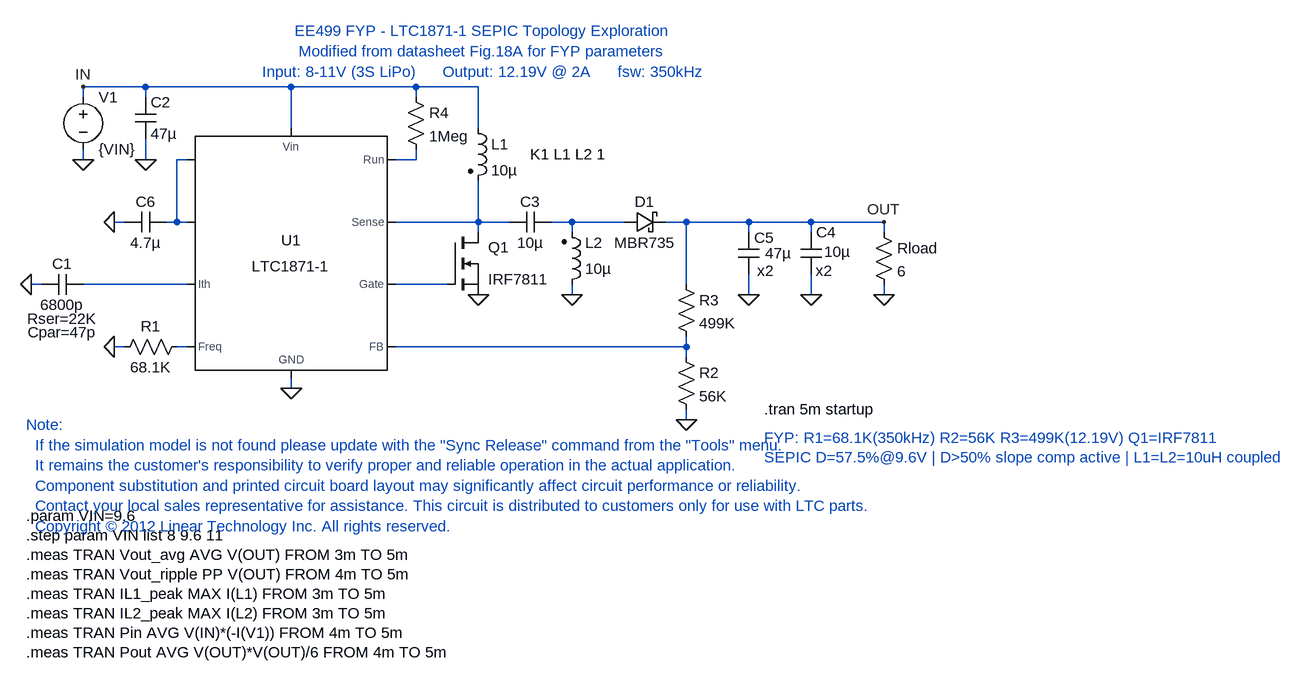
[diagram p0: schematic LTC1871_SEPIC_FYP.asc]
LTC1871_SEPIC_FYP.asc, the LTspice schematic file:
Version 4.1
SHEET 1 2880 2020
WIRE 1408 1120 1312 1120
WIRE 1632 1120 1408 1120
WIRE 1824 1120 1632 1120
WIRE 1920 1120 1824 1120
WIRE 1312 1136 1312 1120
WIRE 1408 1136 1408 1120
WIRE 1824 1136 1824 1120
WIRE 1632 1184 1632 1120
WIRE 1920 1184 1920 1120
WIRE 1312 1232 1312 1216
WIRE 1408 1232 1408 1200
WIRE 1472 1232 1456 1232
WIRE 1824 1232 1824 1216
WIRE 1824 1232 1792 1232
WIRE 1376 1328 1360 1328
WIRE 1456 1328 1456 1232
WIRE 1456 1328 1440 1328
WIRE 1472 1328 1456 1328
WIRE 1920 1328 1920 1264
WIRE 1920 1328 1792 1328
WIRE 1968 1328 1920 1328
WIRE 2064 1328 2032 1328
WIRE 2144 1328 2064 1328
WIRE 2240 1328 2208 1328
WIRE 2336 1328 2240 1328
WIRE 2432 1328 2336 1328
WIRE 2544 1328 2432 1328
WIRE 1920 1344 1920 1328
WIRE 2064 1344 2064 1328
WIRE 2336 1344 2336 1328
WIRE 2432 1344 2432 1328
WIRE 2544 1344 2544 1328
WIRE 1248 1424 1232 1424
WIRE 1472 1424 1312 1424
WIRE 1872 1424 1792 1424
WIRE 2240 1424 2240 1328
WIRE 2064 1440 2064 1424
WIRE 2336 1440 2336 1408
WIRE 2432 1440 2432 1408
WIRE 2544 1440 2544 1424
WIRE 1376 1520 1360 1520
WIRE 1472 1520 1456 1520
WIRE 2240 1520 2240 1504
WIRE 2240 1520 1792 1520
WIRE 2240 1536 2240 1520
WIRE 1632 1584 1632 1568
WIRE 2240 1632 2240 1616
FLAG 1920 1440 0
FLAG 1360 1520 0
FLAG 2240 1632 0
FLAG 1632 1584 0
FLAG 2336 1440 0
FLAG 1232 1424 0
FLAG 2544 1440 0
FLAG 1312 1232 0
FLAG 1360 1328 0
FLAG 1312 1120 IN
FLAG 2544 1328 OUT
FLAG 1408 1232 0
FLAG 2064 1440 0
FLAG 2432 1440 0
SYMBOL NMOS 1872 1344 R0
WINDOW 0 63 23 Left 2
WINDOW 3 63 72 Left 2
SYMATTR InstName Q1
SYMATTR Value IRF7811
SYMBOL RES 1472 1504 R90
WINDOW 0 0 56 VBottom 2
WINDOW 3 32 56 VTop 2
SYMATTR InstName R1
SYMATTR Value 68.1K
SYMBOL res 2224 1520 R0
SYMATTR InstName R2
SYMATTR Value 56K
SYMBOL res 2224 1408 R0
SYMATTR InstName R3
SYMATTR Value 499K
SYMBOL ind2 1904 1168 R0
SYMATTR InstName L1
SYMATTR Value 10µ
SYMATTR SpiceLine Rser=0.010
SYMBOL schottky 2144 1344 R270
WINDOW 0 32 32 VTop 2
WINDOW 3 0 32 VBottom 2
SYMATTR InstName D1
SYMATTR Value MBR735
SYMBOL cap 1312 1408 R90
WINDOW 0 0 32 VBottom 2
WINDOW 3 32 32 VTop 2
WINDOW 39 53 32 VTop 2
WINDOW 40 74 32 VTop 2
SYMATTR InstName C1
SYMATTR Value 6800p
SYMATTR SpiceLine Rser=22K
SYMATTR SpiceLine2 Cpar=47p
SYMBOL VOLTAGE 1312 1120 R0
WINDOW 123 0 0 Left 2
WINDOW 39 -4 -48 Left 2
SYMATTR InstName V1
SYMATTR Value {VIN}
SYMBOL ind2 2048 1440 M180
WINDOW 0 36 80 Left 2
WINDOW 3 36 40 Left 2
SYMATTR InstName L2
SYMATTR Value 10µ
SYMATTR SpiceLine Rser=0.010
SYMBOL cap 1392 1136 R0
SYMATTR InstName C2
SYMATTR Value 47µ
SYMATTR SpiceLine Rser=0.002
SYMBOL cap 2032 1312 R90
WINDOW 0 0 32 VBottom 2
WINDOW 3 32 32 VTop 2
SYMATTR InstName C3
SYMATTR Value 10µ
SYMATTR SpiceLine Rser=0.002
SYMBOL res 1808 1120 R0
SYMATTR InstName R4
SYMATTR Value 1Meg
SYMBOL cap 2416 1408 M180
WINDOW 0 24 64 Left 2
WINDOW 3 36 34 Left 2
WINDOW 40 23 5 Left 2
SYMATTR InstName C4
SYMATTR Value 10µ
SYMATTR SpiceLine2 x2
SYMATTR SpiceLine Rser=0.002
SYMBOL PowerProducts\\LTC1871-1 1632 1376 R0
SYMATTR InstName U1
SYMBOL cap 2320 1344 R0
WINDOW 3 41 32 Left 2
WINDOW 40 29 59 Left 2
SYMATTR Value 47µ
SYMATTR SpiceLine2 x2
SYMATTR InstName C5
SYMATTR SpiceLine Rser=.01
SYMBOL cap 1440 1312 R90
WINDOW 0 0 32 VBottom 2
WINDOW 3 32 32 VTop 2
SYMATTR InstName C6
SYMATTR Value 4.7µ
SYMBOL res 2528 1328 R0
SYMATTR InstName Rload
SYMATTR Value 6
TEXT 2000 1224 Left 2 !K1 L1 L2 1
TEXT 2360 1616 Left 2 !.tran 5m startup
TEXT 1928 1112 Bottom 2 ;EE499 FYP - LTC1871-1 SEPIC Topology Exploration\nModified from datasheet Fig.18A for FYP parameters\nInput: 8-11V (3S LiPo)      Output: 12.19V @ 2A      fsw: 350kHz
TEXT 1224 1780 Left 2 !.param VIN=9.6
TEXT 1224 1810 Left 2 !.step param VIN list 8 9.6 11
TEXT 1224 1840 Left 2 !.meas TRAN Vout_avg AVG V(OUT) FROM 3m TO 5m
TEXT 1224 1870 Left 2 !.meas TRAN Vout_ripple PP V(OUT) FROM 4m TO 5m
TEXT 1224 1900 Left 2 !.meas TRAN IL1_peak MAX I(L1) FROM 3m TO 5m
TEXT 1224 1930 Left 2 !.meas TRAN IL2_peak MAX I(L2) FROM 3m TO 5m
TEXT 1224 1960 Left 2 !.meas TRAN Pin AVG V(IN)*(-I(V1)) FROM 4m TO 5m
TEXT 1224 1990 Left 2 !.meas TRAN Pout AVG V(OUT)*V(OUT)/6 FROM 4m TO 5m
TEXT 2360 1660 Left 2 ;FYP: R1=68.1K(350kHz) R2=56K R3=499K(12.19V) Q1=IRF7811
TEXT 2360 1690 Left 2 ;SEPIC D=57.5%@9.6V | D>50% slope comp active | L1=L2=10uH coupled
TEXT 1224 1640 Left 2 ;Note:\n  If the simulation model is not found please update with the "Sync Release" command from the "Tools" menu.\n  It remains the customer's responsibility to verify proper and reliable operation in the actual application.\n  Component substitution and printed circuit board layout may significantly affect circuit performance or reliability.\n  Contact your local sales representative for assistance. This circuit is distributed to customers only for use with LTC parts.\n  Copyright © 2012 Linear Technology Inc. All rights reserved.

The netlist it stands for:
* LTC1871_SEPIC_FYP.asc
M§Q1 N003 N006 0 0 IRF7811
R1 N007 0 68.1K
R2 N008 0 56K
R3 OUT N008 499K
L1 IN N003 10µ Rser=0.010
D1 N004 OUT MBR735
C1 N005 0 6800p Rser=22K Cpar=47p
V1 IN 0 {VIN}
L2 0 N004 10µ Rser=0.010
C2 IN 0 47µ Rser=0.002
C3 N004 N003 10µ Rser=0.002
R4 IN N002 1Meg
C4 0 OUT 10µ Rser=0.002 x2
X§U1 N002 N005 N008 N007 N001 0 N006 N001 IN N003 LTC1871-1  ; pins Run Ith FB Freq ? GND Gate ? Vin Sense
C5 OUT 0 47µ Rser=.01 x2
C6 N001 0 4.7µ
Rload OUT 0 6
.model D D
.lib standard.dio
.model NMOS NMOS
.model PMOS PMOS
.lib standard.mos
K1 L1 L2 1
.tran 5m startup
* EE499 FYP - LTC1871-1 SEPIC Topology Exploration
* Modified from datasheet Fig.18A for FYP parameters
* Input: 8-11V (3S LiPo)      Output: 12.19V @ 2A      fsw: 350kHz
.param VIN=9.6
.step param VIN list 8 9.6 11
.meas TRAN Vout_avg AVG V(OUT) FROM 3m TO 5m
.meas TRAN Vout_ripple PP V(OUT) FROM 4m TO 5m
.meas TRAN IL1_peak MAX I(L1) FROM 3m TO 5m
.meas TRAN IL2_peak MAX I(L2) FROM 3m TO 5m
.meas TRAN Pin AVG V(IN)*(-I(V1)) FROM 4m TO 5m
.meas TRAN Pout AVG V(OUT)*V(OUT)/6 FROM 4m TO 5m
* FYP: R1=68.1K(350kHz) R2=56K R3=499K(12.19V) Q1=IRF7811
* SEPIC D=57.5%@9.6V | D>50% slope comp active | L1=L2=10uH coupled
* Note:
*   If the simulation model is not found please update with the "Sync Release" command from the "Tools" menu.
*   It remains the customer's responsibility to verify proper and reliable operation in the actual application.
*   Component substitution and printed circuit board layout may significantly affect circuit performance or reliability.
*   Contact your local sales representative for assistance. This circuit is distributed to customers only for use with LTC parts.
*   Copyright © 2012 Linear Technology Inc. All rights reserved.
.lib LTC1871-1.sub
.backanno
.end